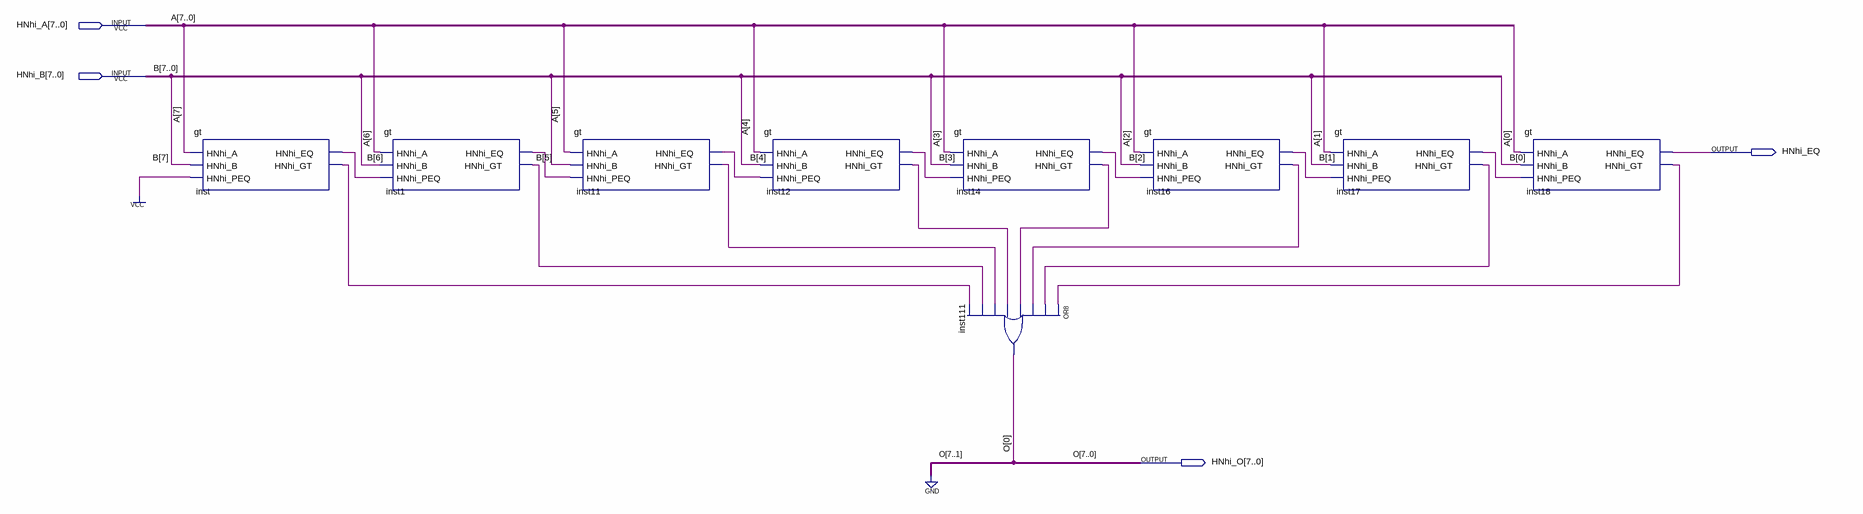
[diagram p0: schematic sheet]
// Quartus schematic gt_8.bdf as structural Verilog: 9 symbols, 4 pins
module gt_8 (
  input  [7:0] HNhi_A,
  input  [7:0] HNhi_B,
  output HNhi_EQ,
  output [7:0] HNhi_O
);

  wire inst1_hnhi_eq, inst1_hnhi_gt, inst11_hnhi_eq, inst11_hnhi_gt, inst12_hnhi_eq, inst12_hnhi_gt,
       inst14_hnhi_eq, inst14_hnhi_gt, inst16_hnhi_eq, inst16_hnhi_gt, inst17_hnhi_eq, inst17_hnhi_gt,
       inst18_hnhi_gt, inst_hnhi_eq, inst_hnhi_gt;

  gt inst (.HNhi_A(HNhi_A[7]), .HNhi_B(HNhi_B[7]), .HNhi_PEQ(1'b1), .HNhi_EQ(inst_hnhi_eq), .HNhi_GT(inst_hnhi_gt));
  gt inst1 (
    .HNhi_A(HNhi_A[6]), .HNhi_B(HNhi_B[6]), .HNhi_PEQ(inst_hnhi_eq), .HNhi_EQ(inst1_hnhi_eq),
    .HNhi_GT(inst1_hnhi_gt));
  gt inst11 (
    .HNhi_A(HNhi_A[5]), .HNhi_B(HNhi_B[5]), .HNhi_PEQ(inst1_hnhi_eq), .HNhi_EQ(inst11_hnhi_eq),
    .HNhi_GT(inst11_hnhi_gt));
  gt inst12 (
    .HNhi_A(HNhi_A[4]), .HNhi_B(HNhi_B[4]), .HNhi_PEQ(inst11_hnhi_eq), .HNhi_EQ(inst12_hnhi_eq),
    .HNhi_GT(inst12_hnhi_gt));
  gt inst14 (
    .HNhi_A(HNhi_A[3]), .HNhi_B(HNhi_B[3]), .HNhi_PEQ(inst12_hnhi_eq), .HNhi_EQ(inst14_hnhi_eq),
    .HNhi_GT(inst14_hnhi_gt));
  or inst111 (HNhi_O[0], inst18_hnhi_gt, inst17_hnhi_gt, inst16_hnhi_gt, inst14_hnhi_gt, inst12_hnhi_gt, inst11_hnhi_gt, inst1_hnhi_gt, inst_hnhi_gt);
  gt inst16 (
    .HNhi_A(HNhi_A[2]), .HNhi_B(HNhi_B[2]), .HNhi_PEQ(inst14_hnhi_eq), .HNhi_EQ(inst16_hnhi_eq),
    .HNhi_GT(inst16_hnhi_gt));
  gt inst17 (
    .HNhi_A(HNhi_A[1]), .HNhi_B(HNhi_B[1]), .HNhi_PEQ(inst16_hnhi_eq), .HNhi_EQ(inst17_hnhi_eq),
    .HNhi_GT(inst17_hnhi_gt));
  gt inst18 (
    .HNhi_A(HNhi_A[0]), .HNhi_B(HNhi_B[0]), .HNhi_PEQ(inst17_hnhi_eq), .HNhi_EQ(HNhi_EQ),
    .HNhi_GT(inst18_hnhi_gt));

  assign HNhi_O[7:1] = {7{1'b0}};

  // Other names for the same wires on the sheet: A[7:0] = HNhi_A; B[7:0] = HNhi_B; O[0] = HNhi_O[0]
endmodule
